# EAGLE design soldering_is_easy (EAGLE 6.4)
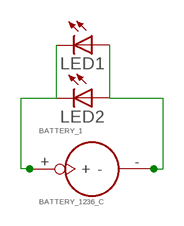
[diagram p0: schematic, sheet 1]

## Parts
BATTERY_1  BATTERY_1236_C  [BATTERY_1236_C]
LED1  LED5MM  [LED5MM]
LED2  LED5MM  [LED5MM]

## Nets
N$1: BATTERY_1.+ LED1.K(C) LED2.K(C)
N$3: BATTERY_1.- LED1.A LED2.A

## Library data of the parts
BATTERY_1 = Itead_BP_110825:BATTERY_1236_C: SOC004
LED1 LED2 = SparkFun-LED:LED: LEDs Standard schematic elements and footprints for 5mm, 3mm, 1206, and 0603 sized LEDs. 5mm - Spark Fun Electronics SKU : COM-00529 (and others)

## Board
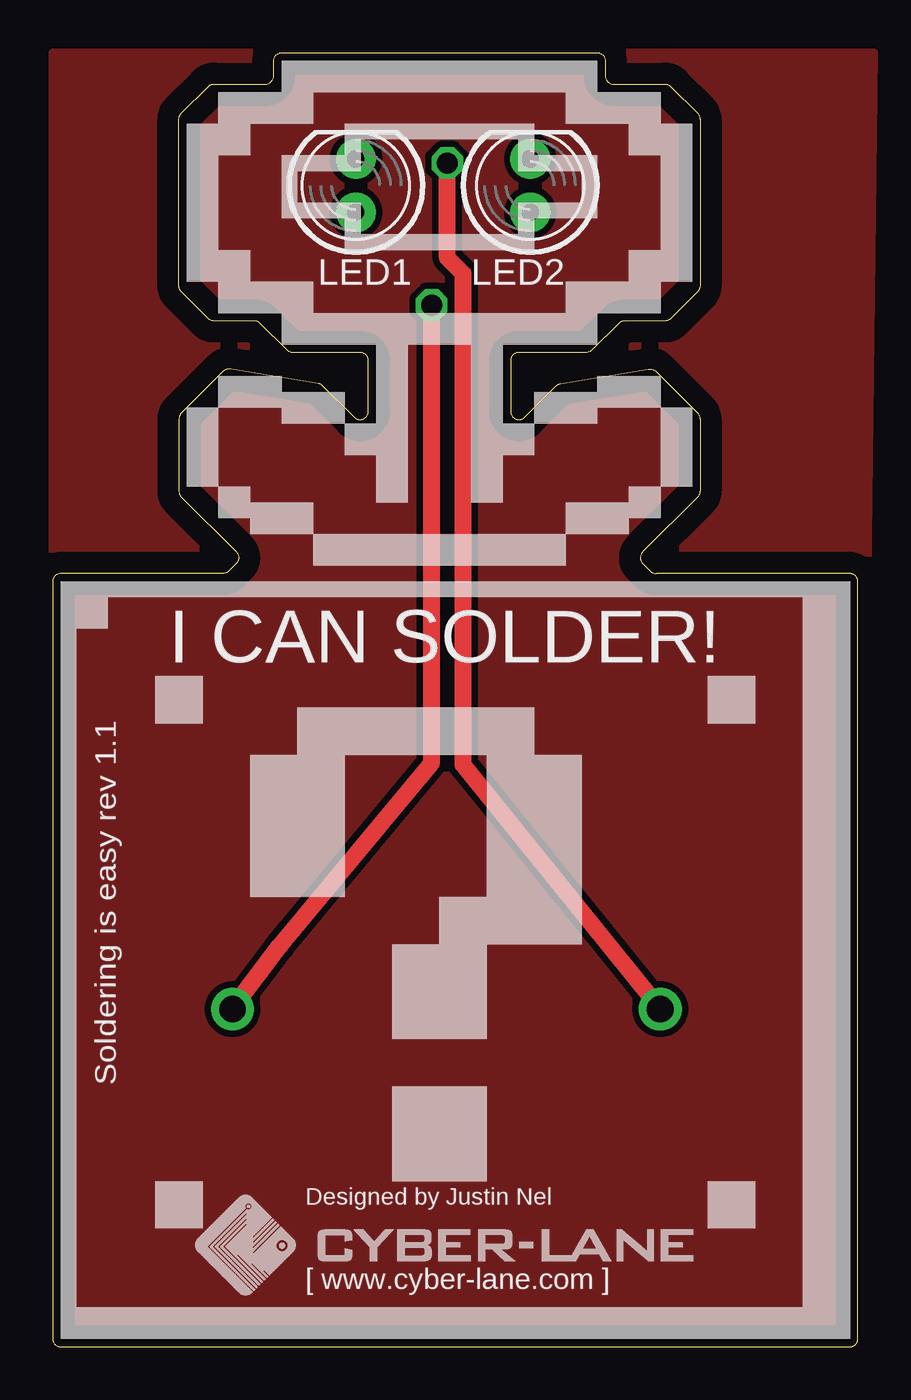
[diagram p1: board, top side]
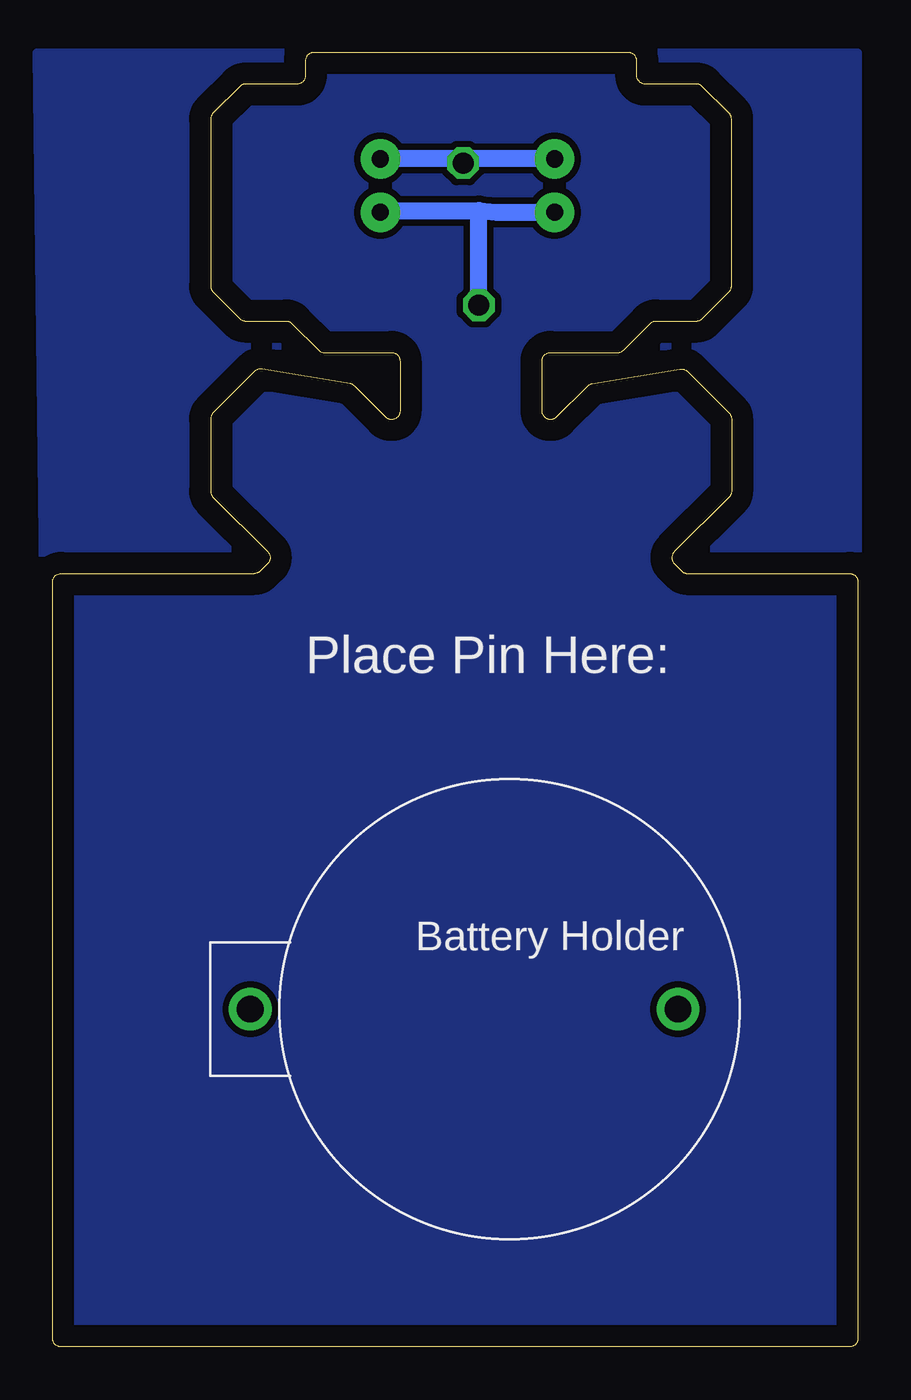
[diagram p2: board, bottom side, seen from below]

Size 38.25 x 61.5 mm. Coordinates in mm from the lower left corner, seen from the top.
Outline: 14.32,44.18 12.84,45.66 arc36 12.62,45.77 8.45,46.47 arc54 8.1,46.35 6.12,44.37 arc45 6,44.08 6,40.67 arc45 6.12,40.38 8.72,37.78 arc-90 8.72,37.22 8.37,36.87 arc-45 8.08,36.75 0.4,36.75 arc90 0,36.35 0,0.4 arc90 0.4,0 37.85,0 arc90 38.25,0.4 38.25,36.35 arc90 37.85,36.75 28.67,36.75 arc-45 28.38,36.87 28.03,37.22 arc-90 28.03,37.78 30.63,40.38 arc45 30.75,40.67 30.75,44.08 arc45 30.63,44.37 28.65,46.35 arc54 28.3,46.47 24.13,45.77 arc36 23.91,45.66 22.43,44.18 arc-135 21.75,44.47 21.75,46.85 arc-90 22.15,47.25 25.33,47.25 arc45 25.62,47.37 26.88,48.63 arc-45 27.17,48.75 29.08,48.75 arc45 29.37,48.87 30.63,50.13 arc45 30.75,50.42 30.75,58.33 arc45 30.63,58.62 29.37,59.88 arc45 29.08,60 26.65,60 arc-90 26.25,60.4 26.25,61.1 arc90 25.85,61.5 10.9,61.5 arc90 10.5,61.1 10.5,60.4 arc-90 10.1,60 7.67,60 arc45 7.38,59.88 6.12,58.62 arc45 6,58.33 6,50.42 arc45 6.12,50.13 7.38,48.87 arc45 7.67,48.75 9.58,48.75 arc-45 9.87,48.63 11.13,47.37 arc45 11.42,47.25 14.6,47.25 arc-90 15,46.85 15,44.47 arc-135 14.32,44.18
Copper layers (1*16): Top 0.035mm / dielectric 1.5mm / Bottom 0.035mm
Design rules "default": minimum track width 10mil, minimum drill 24mil, track to track 8mil, track to pad 8mil, pad to pad 8mil, via to via 8mil, smd to smd 8mil, copper to edge 40mil, drill to drill 8mil, minimum pad ring 10mil, minimum via ring 8mil, stop-mask expansion 4mil, vias tented up to drill 0mil, thermal gap 10mil
bKeepout: area 0.2,30 to 38.2,36

### Footprints (pad centres in the part's own frame; a part is rotated, then mirrored left to right if it is on the bottom)
BATTERY_1236_C = drill 1.27 pad 2.032: + 0,0; - 0,20.32
LED5MM = drill 0.813 pad 1.88: A -1.27,0; K 1.27,0

### Placement (x,y rotation side)
BATTERY_1  28.86,16.05 270 bottom
LED1  14.41,55.18 90 top
LED2  22.69,55.18 90 top

### Tracks (layer width: path | path; a pad name or v marks a point on that pad's centre or on a via)
GND
  pour Top (isolate 0.305): 38.25,0 0,0 0,61.5 39,61.5
N$1  (via drill 1)
  Top 0.813: BATTERY_1.+ 19.5,27.66 19.5,51 18.75,51.75 v18.75,56.25
  Bottom 0.813: LED2.K 18.95,56.45 v18.75,56.25 18.55,56.45 LED1.K
N$2
  pour Bottom (isolate 0.305): 0,0 38.25,0 39,61.5 0,61.5
N$3  (via drill 1)
  Top 0.813: BATTERY_1.- 10.8,19.05 18,27.75 v18,49.5
  Bottom 0.813: v18,49.5 18,54 | 18,54 17.16,53.91 LED1.A | LED2.A 22.6,54 18,54

### Text on the board
tPlace: I CAN SOLDER! | Soldering is easy rev 1.1 | Designed by Justin Nel | [ www.cyber-lane.com ]
bPlace: Place Pin Here: | Battery Holder